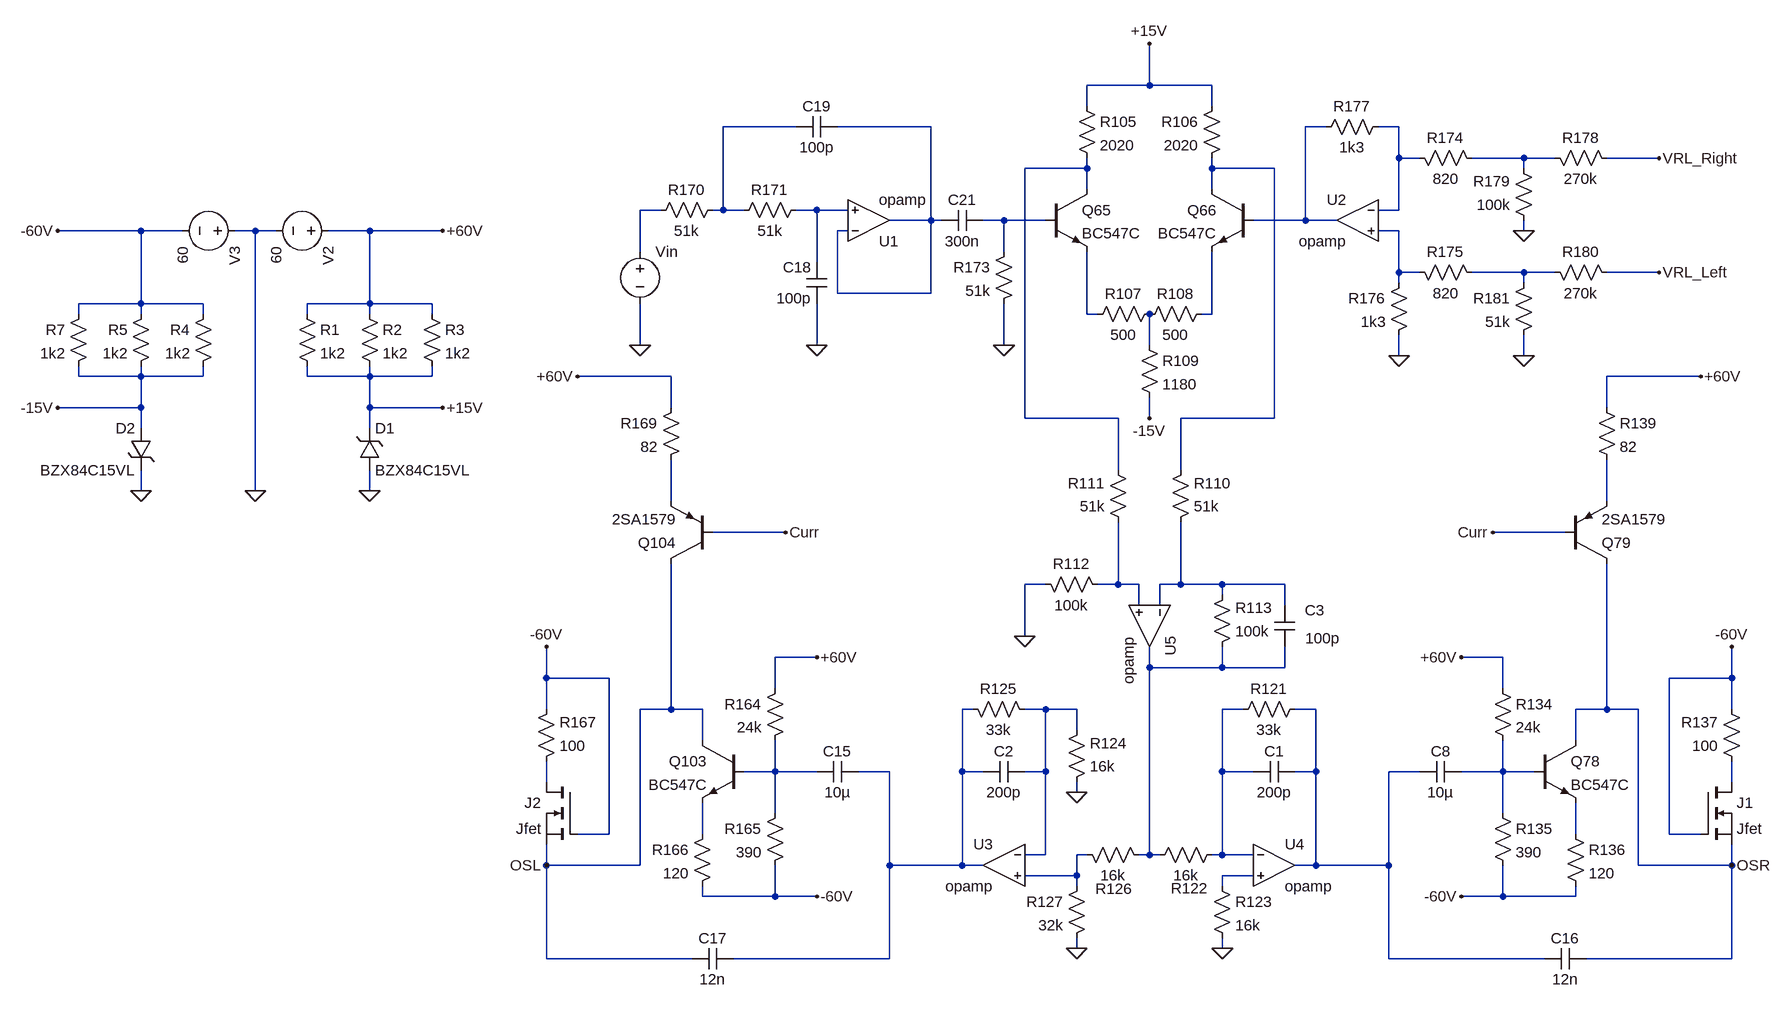
[diagram p0: schematic VOPTEX1.asc]
VOPTEX1.asc, the LTspice schematic file:
Version 4
SHEET 1 16980 7392
WIRE 8912 2656 8912 2592
WIRE 8912 2656 8816 2656
WIRE 9008 2656 8912 2656
WIRE 8816 2688 8816 2656
WIRE 9008 2688 9008 2656
WIRE 8368 2720 8256 2720
WIRE 8576 2720 8432 2720
WIRE 9184 2720 9152 2720
WIRE 9296 2720 9264 2720
WIRE 9296 2768 9296 2720
WIRE 9328 2768 9296 2768
WIRE 9488 2768 9408 2768
WIRE 9536 2768 9488 2768
WIRE 9696 2768 9616 2768
WIRE 8816 2784 8816 2768
WIRE 8816 2784 8720 2784
WIRE 9008 2784 9008 2768
WIRE 9104 2784 9008 2784
WIRE 9488 2784 9488 2768
WIRE 8816 2816 8816 2784
WIRE 9008 2816 9008 2784
WIRE 8160 2848 8128 2848
WIRE 8256 2848 8256 2720
WIRE 8256 2848 8240 2848
WIRE 8288 2848 8256 2848
WIRE 8400 2848 8368 2848
WIRE 8448 2848 8400 2848
WIRE 9296 2848 9296 2768
WIRE 9296 2848 9264 2848
WIRE 8576 2864 8576 2720
WIRE 8576 2864 8512 2864
WIRE 8592 2864 8576 2864
WIRE 8688 2864 8656 2864
WIRE 8752 2864 8688 2864
WIRE 9152 2864 9152 2720
WIRE 9152 2864 9072 2864
WIRE 9200 2864 9152 2864
WIRE 7360 2880 7232 2880
WIRE 7424 2880 7360 2880
WIRE 7536 2880 7504 2880
WIRE 7568 2880 7536 2880
WIRE 7712 2880 7648 2880
WIRE 7824 2880 7712 2880
WIRE 8448 2880 8432 2880
WIRE 9296 2880 9264 2880
WIRE 9488 2880 9488 2864
WIRE 8128 2912 8128 2848
WIRE 8688 2912 8688 2864
WIRE 8400 2928 8400 2848
WIRE 9296 2944 9296 2880
WIRE 9328 2944 9296 2944
WIRE 9488 2944 9408 2944
WIRE 9536 2944 9488 2944
WIRE 9696 2944 9616 2944
WIRE 9296 2960 9296 2944
WIRE 9488 2960 9488 2944
WIRE 8432 2976 8432 2880
WIRE 8576 2976 8576 2864
WIRE 8576 2976 8432 2976
WIRE 7360 2992 7360 2880
WIRE 7360 2992 7264 2992
WIRE 7456 2992 7360 2992
WIRE 7712 2992 7712 2880
WIRE 7712 2992 7616 2992
WIRE 7808 2992 7712 2992
WIRE 7264 3008 7264 2992
WIRE 7360 3008 7360 2992
WIRE 7456 3008 7456 2992
WIRE 7616 3008 7616 2992
WIRE 7712 3008 7712 2992
WIRE 7808 3008 7808 2992
WIRE 8816 3008 8816 2912
WIRE 8832 3008 8816 3008
WIRE 9008 3008 9008 2912
WIRE 9008 3008 8992 3008
WIRE 8128 3056 8128 2992
WIRE 8400 3056 8400 2992
WIRE 8688 3056 8688 2992
WIRE 8912 3056 8912 3008
WIRE 9296 3072 9296 3040
WIRE 9488 3072 9488 3040
WIRE 7264 3104 7264 3088
WIRE 7360 3104 7360 3088
WIRE 7360 3104 7264 3104
WIRE 7456 3104 7456 3088
WIRE 7456 3104 7360 3104
WIRE 7616 3104 7616 3088
WIRE 7712 3104 7712 3088
WIRE 7712 3104 7616 3104
WIRE 7808 3104 7808 3088
WIRE 7808 3104 7712 3104
WIRE 8176 3104 8032 3104
WIRE 9760 3104 9616 3104
WIRE 7360 3152 7360 3104
WIRE 7360 3152 7232 3152
WIRE 7712 3152 7712 3104
WIRE 7824 3152 7712 3152
WIRE 8176 3152 8176 3104
WIRE 9616 3152 9616 3104
WIRE 8720 3168 8720 2784
WIRE 8864 3168 8720 3168
WIRE 8912 3168 8912 3136
WIRE 9104 3168 9104 2784
WIRE 9104 3168 8960 3168
WIRE 7360 3184 7360 3152
WIRE 7712 3184 7712 3152
WIRE 8864 3248 8864 3168
WIRE 8960 3248 8960 3168
WIRE 7360 3280 7360 3248
WIRE 7536 3280 7536 2880
WIRE 7712 3280 7712 3248
WIRE 8176 3296 8176 3232
WIRE 9616 3296 9616 3232
WIRE 8352 3344 8240 3344
WIRE 9552 3344 9440 3344
WIRE 8752 3424 8720 3424
WIRE 8864 3424 8864 3328
WIRE 8864 3424 8832 3424
WIRE 8896 3424 8864 3424
WIRE 8960 3424 8960 3328
WIRE 8960 3424 8928 3424
WIRE 9024 3424 8960 3424
WIRE 9120 3424 9024 3424
WIRE 9024 3440 9024 3424
WIRE 8896 3456 8896 3424
WIRE 8928 3456 8928 3424
WIRE 9120 3456 9120 3424
WIRE 8720 3504 8720 3424
WIRE 8400 3536 8336 3536
WIRE 9456 3536 9392 3536
WIRE 8912 3552 8912 3520
WIRE 9024 3552 9024 3520
WIRE 9024 3552 8912 3552
WIRE 9120 3552 9120 3520
WIRE 9120 3552 9024 3552
WIRE 7984 3568 7984 3520
WIRE 8080 3568 7984 3568
WIRE 9808 3568 9808 3520
WIRE 9808 3568 9712 3568
WIRE 8336 3584 8336 3536
WIRE 9456 3584 9456 3536
WIRE 7984 3616 7984 3568
WIRE 8176 3616 8176 3392
WIRE 8176 3616 8128 3616
WIRE 8224 3616 8176 3616
WIRE 8640 3616 8624 3616
WIRE 8752 3616 8720 3616
WIRE 8800 3616 8752 3616
WIRE 9056 3616 9024 3616
WIRE 9168 3616 9136 3616
WIRE 9616 3616 9616 3392
WIRE 9616 3616 9568 3616
WIRE 9664 3616 9616 3616
WIRE 9808 3616 9808 3568
WIRE 8800 3648 8800 3616
WIRE 8224 3664 8224 3616
WIRE 9568 3664 9568 3616
WIRE 8336 3712 8336 3664
WIRE 8336 3712 8288 3712
WIRE 8400 3712 8336 3712
WIRE 8512 3712 8464 3712
WIRE 8624 3712 8624 3616
WIRE 8656 3712 8624 3712
WIRE 8752 3712 8752 3616
WIRE 8752 3712 8720 3712
WIRE 9024 3712 9024 3616
WIRE 9072 3712 9024 3712
WIRE 9168 3712 9168 3616
WIRE 9168 3712 9136 3712
WIRE 9328 3712 9280 3712
WIRE 9456 3712 9456 3664
WIRE 9456 3712 9392 3712
WIRE 9504 3712 9456 3712
WIRE 7984 3728 7984 3696
WIRE 9808 3728 9808 3696
WIRE 8800 3744 8800 3728
WIRE 8336 3776 8336 3712
WIRE 9456 3776 9456 3712
WIRE 8080 3808 8080 3568
WIRE 8080 3808 8032 3808
WIRE 8224 3808 8224 3760
WIRE 9568 3808 9568 3760
WIRE 9712 3808 9712 3568
WIRE 9760 3808 9712 3808
WIRE 8752 3840 8752 3712
WIRE 8752 3840 8720 3840
WIRE 8816 3840 8800 3840
WIRE 8912 3840 8912 3552
WIRE 8912 3840 8896 3840
WIRE 8928 3840 8912 3840
WIRE 9024 3840 9024 3712
WIRE 9024 3840 9008 3840
WIRE 9072 3840 9024 3840
WIRE 7984 3856 7984 3824
WIRE 8128 3856 8128 3616
WIRE 8128 3856 7984 3856
WIRE 8512 3856 8512 3712
WIRE 8624 3856 8624 3712
WIRE 8624 3856 8512 3856
WIRE 8656 3856 8624 3856
WIRE 9168 3856 9168 3712
WIRE 9168 3856 9136 3856
WIRE 9280 3856 9280 3712
WIRE 9280 3856 9168 3856
WIRE 9664 3856 9664 3616
WIRE 9808 3856 9808 3824
WIRE 9808 3856 9664 3856
WIRE 8800 3872 8800 3840
WIRE 8800 3872 8720 3872
WIRE 9072 3872 9024 3872
WIRE 8800 3888 8800 3872
WIRE 9024 3888 9024 3872
WIRE 8224 3904 8224 3888
WIRE 8336 3904 8336 3856
WIRE 8336 3904 8224 3904
WIRE 8400 3904 8336 3904
WIRE 9456 3904 9456 3856
WIRE 9456 3904 9392 3904
WIRE 9568 3904 9568 3888
WIRE 9568 3904 9456 3904
WIRE 8800 3984 8800 3968
WIRE 9024 3984 9024 3968
WIRE 7984 4000 7984 3856
WIRE 8208 4000 7984 4000
WIRE 8512 4000 8512 3856
WIRE 8512 4000 8272 4000
WIRE 9280 4000 9280 3856
WIRE 9520 4000 9280 4000
WIRE 9808 4000 9808 3856
WIRE 9808 4000 9584 4000
FLAG 7536 3280 0
FLAG 7824 2880 +60V
FLAG 7232 2880 -60V
FLAG 8912 3168 -15V
FLAG 8912 2592 +15V
FLAG 8720 3504 0
FLAG 9024 3984 0
FLAG 8800 3744 0
FLAG 8800 3984 0
FLAG 9392 3536 +60V
FLAG 9392 3904 -60V
FLAG 8400 3536 +60V
FLAG 8400 3904 -60V
FLAG 8128 3056 0
FLAG 8400 3056 0
FLAG 8688 3056 0
FLAG 9488 2880 0
FLAG 9488 3072 0
FLAG 9296 3072 0
FLAG 9808 3520 -60V
FLAG 7984 3520 -60V
FLAG 7712 3280 0
FLAG 7360 3280 0
FLAG 7824 3152 +15V
FLAG 7232 3152 -15V
FLAG 9440 3344 Curr
FLAG 8352 3344 Curr
FLAG 8032 3104 +60V
FLAG 9760 3104 +60V
FLAG 7984 3856 OSL
FLAG 9808 3856 OSR
FLAG 9696 2944 VRL_Left
FLAG 9696 2768 VRL_Right
SYMBOL voltage 7664 2880 R90
WINDOW 123 0 0 Left 0
WINDOW 39 24 44 Left 2
SYMATTR InstName V2
SYMATTR Value 60
SYMBOL voltage 7520 2880 R90
WINDOW 123 0 0 Left 0
WINDOW 39 24 124 Left 2
SYMATTR InstName V3
SYMATTR Value 60
SYMBOL npn 8752 2816 R0
SYMATTR InstName Q65
SYMATTR Value BC547C
SYMBOL npn 9072 2816 M0
SYMATTR InstName Q66
SYMATTR Value BC547C
SYMBOL res 8800 2672 R0
SYMATTR InstName R105
SYMATTR Value 2020
SYMBOL res 9024 2672 M0
SYMATTR InstName R106
SYMATTR Value 2020
SYMBOL res 8928 2992 R90
WINDOW 0 0 56 VBottom 2
WINDOW 3 32 56 VTop 2
SYMATTR InstName R107
SYMATTR Value 500
SYMBOL res 9008 2992 R90
WINDOW 0 0 56 VBottom 2
WINDOW 3 32 56 VTop 2
SYMATTR InstName R108
SYMATTR Value 500
SYMBOL res 8896 3040 R0
SYMATTR InstName R109
SYMATTR Value 1180
SYMBOL res 8944 3344 M180
WINDOW 0 36 76 Left 2
WINDOW 3 36 40 Left 2
SYMATTR InstName R110
SYMATTR Value 51k
SYMBOL res 8880 3344 R180
WINDOW 0 36 76 Left 2
WINDOW 3 36 40 Left 2
SYMATTR InstName R111
SYMATTR Value 51k
SYMBOL res 8848 3440 M270
WINDOW 0 32 56 VTop 2
WINDOW 3 0 56 VBottom 2
SYMATTR InstName R112
SYMATTR Value 100k
SYMBOL res 9008 3536 M180
WINDOW 0 36 76 Left 2
WINDOW 3 36 40 Left 2
SYMATTR InstName R113
SYMATTR Value 100k
SYMBOL res 9152 3600 R90
WINDOW 0 0 56 VBottom 2
WINDOW 3 32 56 VTop 2
SYMATTR InstName R121
SYMATTR Value 33k
SYMBOL res 9024 3824 R90
WINDOW 0 83 50 VBottom 2
WINDOW 3 32 56 VTop 2
SYMATTR InstName R122
SYMATTR Value 16k
SYMBOL res 9008 3872 R0
SYMATTR InstName R123
SYMATTR Value 16k
SYMBOL res 8784 3744 M180
WINDOW 0 36 76 Left 2
WINDOW 3 36 40 Left 2
SYMATTR InstName R124
SYMATTR Value 16k
SYMBOL res 8624 3600 M90
WINDOW 0 0 56 VBottom 2
WINDOW 3 32 56 VTop 2
SYMATTR InstName R125
SYMATTR Value 33k
SYMBOL res 8912 3856 M270
WINDOW 0 -52 54 VTop 2
WINDOW 3 0 56 VBottom 2
SYMATTR InstName R126
SYMATTR Value 16k
SYMBOL res 8816 3872 M0
SYMATTR InstName R127
SYMATTR Value 32k
SYMBOL cap 9392 3696 R90
WINDOW 0 0 32 VBottom 2
WINDOW 3 32 32 VTop 2
SYMATTR InstName C8
SYMATTR Value 10µ
SYMATTR SpiceLine Rser=0.1
SYMBOL res 9440 3568 R0
SYMATTR InstName R134
SYMATTR Value 24k
SYMBOL res 9440 3760 R0
SYMATTR InstName R135
SYMATTR Value 390
SYMBOL npn 9504 3664 R0
SYMATTR InstName Q78
SYMATTR Value BC547C
SYMBOL res 9552 3792 R0
SYMATTR InstName R136
SYMATTR Value 120
SYMBOL res 9824 3712 R180
WINDOW 0 36 76 Left 2
WINDOW 3 36 40 Left 2
SYMATTR InstName R137
SYMATTR Value 100
SYMBOL pnp 9552 3392 M180
SYMATTR InstName Q79
SYMATTR Value 2SA1579
SYMBOL res 9600 3136 R0
SYMATTR InstName R139
SYMATTR Value 82
SYMBOL cap 9584 3984 R90
WINDOW 0 0 32 VBottom 2
WINDOW 3 32 32 VTop 2
SYMATTR InstName C16
SYMATTR Value 12n
SYMATTR SpiceLine Rser=0.1
SYMBOL cap 8400 3696 M90
WINDOW 0 0 32 VBottom 2
WINDOW 3 32 32 VTop 2
SYMATTR InstName C15
SYMATTR Value 10µ
SYMATTR SpiceLine Rser=0.1
SYMBOL res 8352 3568 M0
SYMATTR InstName R164
SYMATTR Value 24k
SYMBOL res 8352 3760 M0
SYMATTR InstName R165
SYMATTR Value 390
SYMBOL npn 8288 3664 M0
SYMATTR InstName Q103
SYMATTR Value BC547C
SYMBOL res 8240 3792 M0
SYMATTR InstName R166
SYMATTR Value 120
SYMBOL res 7968 3712 M180
WINDOW 0 36 76 Left 2
WINDOW 3 36 40 Left 2
SYMATTR InstName R167
SYMATTR Value 100
SYMBOL pnp 8240 3392 R180
SYMATTR InstName Q104
SYMATTR Value 2SA1579
SYMBOL res 8192 3136 M0
SYMATTR InstName R169
SYMATTR Value 82
SYMBOL cap 8208 3984 M90
WINDOW 0 0 32 VBottom 2
WINDOW 3 32 32 VTop 2
SYMATTR InstName C17
SYMATTR Value 12n
SYMATTR SpiceLine Rser=0.1
SYMBOL res 8256 2832 R90
WINDOW 0 0 56 VBottom 2
WINDOW 3 32 56 VTop 2
SYMATTR InstName R170
SYMATTR Value 51k
SYMBOL res 8384 2832 R90
WINDOW 0 0 56 VBottom 2
WINDOW 3 32 56 VTop 2
SYMATTR InstName R171
SYMATTR Value 51k
SYMBOL cap 8416 2928 M0
SYMATTR InstName C18
SYMATTR Value 100p
SYMATTR SpiceLine Rser=0.1
SYMBOL cap 8432 2736 M270
WINDOW 0 32 32 VTop 2
WINDOW 3 0 32 VBottom 2
SYMATTR InstName C19
SYMATTR Value 100p
SYMATTR SpiceLine Rser=0.1
SYMBOL voltage 8128 2896 R0
WINDOW 123 24 124 Left 2
WINDOW 39 0 0 Left 0
SYMATTR InstName Vin
SYMATTR Value ""
SYMBOL cap 8656 2848 R90
WINDOW 0 0 32 VBottom 2
WINDOW 3 32 32 VTop 2
SYMATTR InstName C21
SYMATTR Value 300n
SYMATTR SpiceLine Rser=0.1
SYMBOL res 8704 2896 M0
SYMATTR InstName R173
SYMATTR Value 51k
SYMBOL res 9312 2752 M90
WINDOW 0 0 56 VBottom 2
WINDOW 3 32 56 VTop 2
SYMATTR InstName R174
SYMATTR Value 820
SYMBOL res 9312 2928 M90
WINDOW 0 0 56 VBottom 2
WINDOW 3 32 56 VTop 2
SYMATTR InstName R175
SYMATTR Value 820
SYMBOL res 9312 2944 M0
SYMATTR InstName R176
SYMATTR Value 1k3
SYMBOL res 9168 2736 R270
WINDOW 0 32 56 VTop 2
WINDOW 3 0 56 VBottom 2
SYMATTR InstName R177
SYMATTR Value 1k3
SYMBOL res 9520 2752 M90
WINDOW 0 0 56 VBottom 2
WINDOW 3 32 56 VTop 2
SYMATTR InstName R178
SYMATTR Value 270k
SYMBOL res 9504 2880 R180
WINDOW 0 36 76 Left 2
WINDOW 3 36 40 Left 2
SYMATTR InstName R179
SYMATTR Value 100k
SYMBOL res 9632 2960 M270
WINDOW 0 32 56 VTop 2
WINDOW 3 0 56 VBottom 2
SYMATTR InstName R180
SYMATTR Value 270k
SYMBOL res 9504 2944 M0
SYMATTR InstName R181
SYMATTR Value 51k
SYMBOL res 7600 2992 R0
SYMATTR InstName R1
SYMATTR Value 1k2
SYMBOL res 7696 2992 R0
SYMATTR InstName R2
SYMATTR Value 1k2
SYMBOL res 7792 2992 R0
SYMATTR InstName R3
SYMATTR Value 1k2
SYMBOL res 7472 2992 M0
SYMATTR InstName R4
SYMATTR Value 1k2
SYMBOL res 7376 2992 M0
SYMATTR InstName R5
SYMATTR Value 1k2
SYMBOL res 7280 2992 M0
SYMATTR InstName R7
SYMATTR Value 1k2
SYMBOL zener 7696 3248 M180
WINDOW 0 24 64 Left 2
WINDOW 3 24 0 Left 2
SYMATTR InstName D1
SYMATTR Value BZX84C15VL
SYMBOL zener 7376 3184 M0
SYMATTR InstName D2
SYMATTR Value BZX84C15VL
SYMBOL cap 9136 3696 R90
WINDOW 0 0 32 VBottom 2
WINDOW 3 32 32 VTop 2
SYMATTR InstName C1
SYMATTR Value 200p
SYMBOL cap 8720 3696 R90
WINDOW 0 0 32 VBottom 2
WINDOW 3 32 32 VTop 2
SYMATTR InstName C2
SYMATTR Value 200p
SYMBOL cap 9136 3520 R180
WINDOW 0 -46 56 Left 2
WINDOW 3 -70 13 Left 2
SYMATTR InstName C3
SYMATTR Value 100p
SYMBOL nmos 9760 3728 R0
SYMATTR InstName J1
SYMATTR Value Jfet
SYMBOL nmos 8032 3728 M0
SYMATTR InstName J2
SYMATTR Value Jfet
SYMBOL Opamps\\opamp 8480 2928 M180
SYMATTR InstName U1
SYMBOL Opamps\\opamp 9232 2800 M0
SYMATTR InstName U2
SYMBOL Opamps\\opamp 8688 3792 M0
SYMATTR InstName U3
SYMBOL Opamps\\opamp 9104 3792 R0
SYMATTR InstName U4
SYMBOL Opamps\\opamp 8976 3488 R90
SYMATTR InstName U5

The netlist it stands for:
* VOPTEX1.asc
V2 +60V 0 60
V3 0 -60V 60
Q65 N006 N010 N013 0 BC547C
Q66 N007 N003 N014 0 BC547C
R105 +15V N006 2020
R106 +15V N007 2020
R107 N015 N013 500
R108 N014 N015 500
R109 N015 -15V 1180
R110 N019 N007 51k
R111 N018 N006 51k
R112 N018 0 100k
R113 N020 N019 100k
R121 N024 N023 33k
R122 N023 N020 16k
R123 N032 0 16k
R124 0 N022 16k
R125 N021 N022 33k
R126 N020 N031 16k
R127 N031 0 32k
C8 N026 N024 10µ Rser=0.1
R134 +60V N026 24k
R135 N026 -60V 390
Q78 OSR N026 N030 0 BC547C
R136 N030 -60V 120
R137 N028 -60V 100
Q79 OSR Curr N017 0 2SA1579
R139 +60V N017 82
C16 OSR N024 12n Rser=0.1
C15 N025 N021 10µ Rser=0.1
R164 +60V N025 24k
R165 N025 -60V 390
Q103 OSL N025 N029 0 BC547C
R166 N029 -60V 120
R167 N027 -60V 100
Q104 OSL Curr N016 0 2SA1579
R169 +60V N016 82
C17 OSL N021 12n Rser=0.1
R170 N001 N008 51k
R171 N009 N001 51k
C18 N009 0 100p Rser=0.1
C19 N002 N001 100p Rser=0.1
Vin N008 0
C21 N010 N002 300n Rser=0.1
R173 N010 0 51k
R174 N004 N005 820
R175 N011 N012 820
R176 N011 0 1k3
R177 N003 N004 1k3
R178 N005 VRL_Right 270k
R179 0 N005 100k
R180 VRL_Left N012 270k
R181 N012 0 51k
R1 +60V +15V 1k2
R2 +60V +15V 1k2
R3 +60V +15V 1k2
R4 -60V -15V 1k2
R5 -60V -15V 1k2
R7 -60V -15V 1k2
D1 0 +15V BZX84C15VL
D2 -15V 0 BZX84C15VL
C1 N024 N023 200p
C2 N022 N021 200p
C3 N020 N019 100p
M§J1 N028 -60V OSR OSR Jfet
M§J2 N027 -60V OSL OSL Jfet
XU1 N002 N009 N002 opamp Aol=100K GBW=10Meg  ; pins invin noninvin out
XU2 N004 N011 N003 opamp Aol=100K GBW=10Meg  ; pins invin noninvin out
XU3 N022 N031 N021 opamp Aol=100K GBW=10Meg  ; pins invin noninvin out
XU4 N023 N032 N024 opamp Aol=100K GBW=10Meg  ; pins invin noninvin out
XU5 N019 N018 N020 opamp Aol=100K GBW=10Meg  ; pins invin noninvin out
.model D D
.lib standard.dio
.model NPN NPN
.model PNP PNP
.lib standard.bjt
.model NMOS NMOS
.model PMOS PMOS
.lib standard.mos
.backanno
.end